# EAGLE schematic cc (EAGLE 7.1.0)
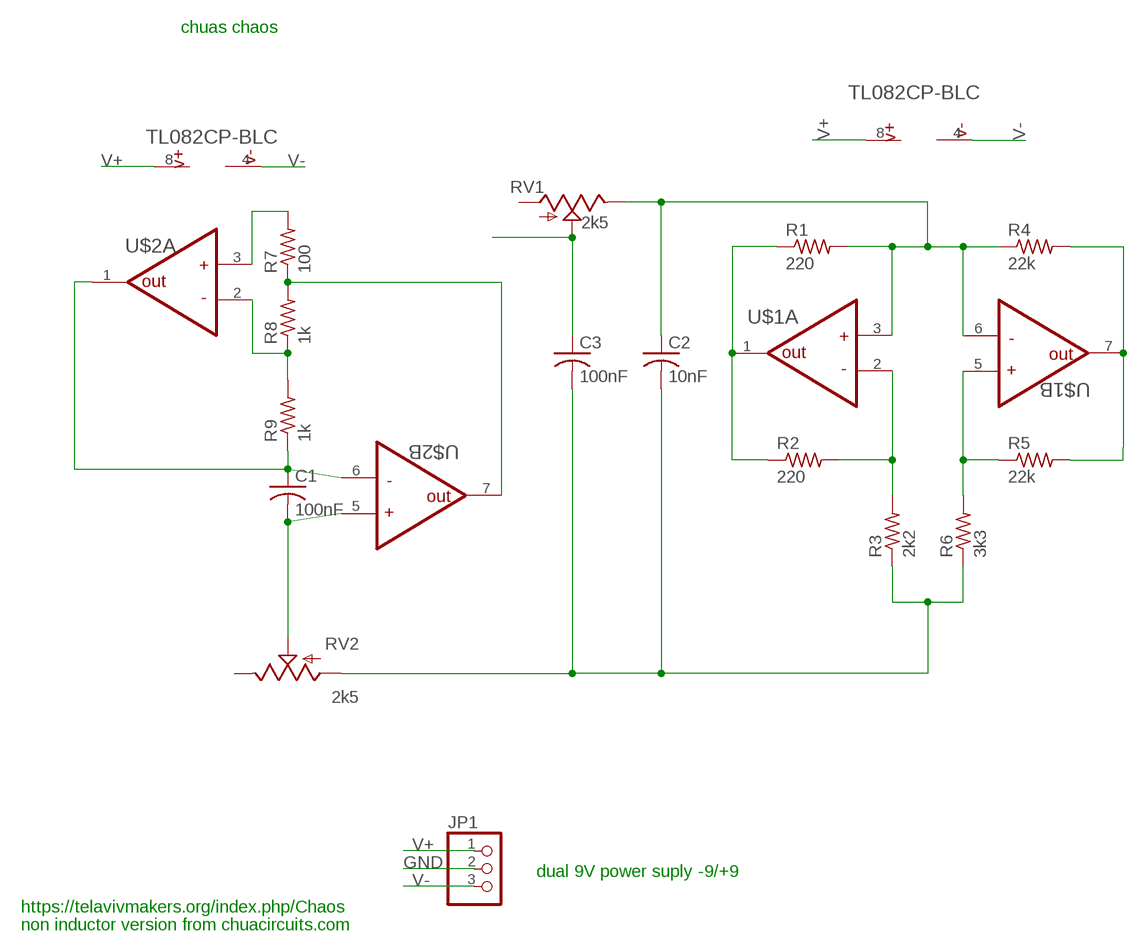
[diagram p0: schematic, sheet 1]

## Parts
C1  100nF  C-US025-024X044  [C025-024X044]
C2  10nF  C-US025-024X044  [C025-024X044]
C3  100nF  C-US025-024X044  [C025-024X044]
JP1  PINHD-1X3  [1X03]
R1  220  R-US_0204/5  [0204/5]
R2  220  R-US_0204/5  [0204/5]
R3  2k2  R-US_0204/5  [0204/5]
R4  22k  R-US_0204/5  [0204/5]
R5  22k  R-US_0204/5  [0204/5]
R6  3k3  R-US_0204/5  [0204/5]
R7  100  R-US_0204/5  [0204/5]
R8  1k  R-US_0204/5  [0204/5]
R9  1k  R-US_0204/5  [0204/5]
RV1  2k5  POT-RV16AF-20  [POT_ALPHA_RV16AF-20]
RV2  2k5  POT-RV16AF-20  [POT_ALPHA_RV16AF-20]
U$1  TL082CP-BLC  [DIP254P762X508-8]
U$2  TL082CP-BLC  [DIP254P762X508-8]

## Nets
GND: JP1.2
N$1: R4.2 R5.2 U$1.7(B:OUT)
N$2: R5.1 R6.2 U$1.5(B:+)
N$3: R7.1 R8.2 U$2.7(B:OUT)
N$4: C2.1 R1.2 R4.1 RV1.3(E) U$1.3(A:+) U$1.6(B:-)
N$5: R2.2 R3.2 U$1.2(A:-)
N$6: R1.1 R2.1 U$1.1(A:OUT)
N$7: C2.2 C3.2 R3.1 R6.1 RV2.1(A)
N$8: C3.1 RV1.2(S)
N$9: R8.1 R9.2 U$2.2(A:-)
N$10: R7.2 U$2.3(A:+)
N$11: C1.1 R9.1 U$2.1(A:OUT) U$2.6(B:-)
N$13: C1.2 RV2.2(S) U$2.5(B:+)
V+: JP1.1 U$1.8 U$2.8
V-: JP1.3 U$1.4 U$2.4
Unconnected: RV1.1(A) RV2.3(E)

## Notes on the sheet
- chuas chaos
- dual 9V power suply -9/+9
- https://telavivmakers.org/index.php/Chaos
- non inductor version from chuacircuits.com

## Library data of the parts
C1-C3 = adafruit:C-US: CAPACITOR, American symbol
JP1 = adafruit:PINHD-1X3: PIN HEADER
R1-R9 = adafruit:R-US_: RESISTOR, American symbol
RV1 RV2 = SparkFun-Electromechanical:POT
U$1 U$2 = chua:TL082CP-BLC